# EAGLE schematic LM399_reference_board (EAGLE 7.2.0)
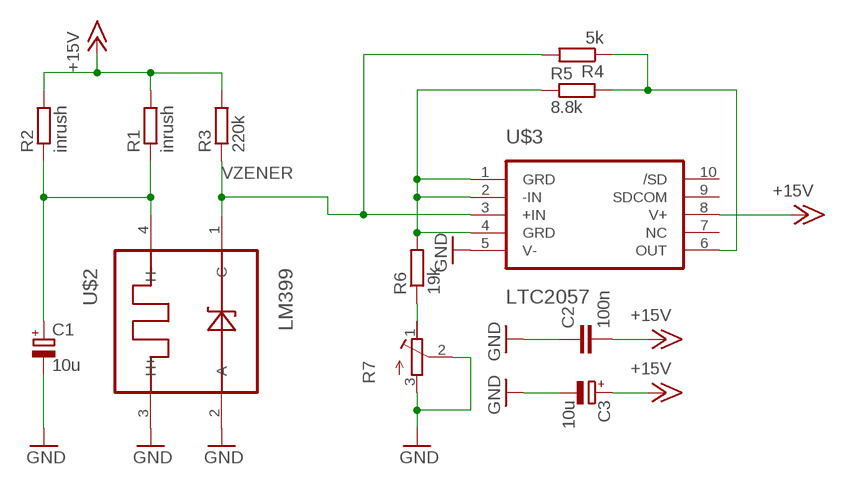
[diagram p0: schematic, sheet 1]

## Parts
C1  10u  CPOL-EUSMCD  [SMC_D]
C2  100n  C-EUC0603  [C0603]
C3  10u  CPOL-EUSMCD  [SMC_D]
R1  inrush  R-EU_R1206  [R1206]
R2  inrush  R-EU_0309/12  [0309/12]
R3  220k  R-EU_0207/10  [0207/10]
R4  5k  R-EU_0207/10  [0207/10]
R5  8.8k  R-EU_0207/10  [0207/10]
R6  19k  R-EU_0207/10  [0207/10]
R7  R-TRIMMT93YA  [RTRIMT93YA]
U$2  LM399  [H4-TO46-4PIN]
U$3  LTC2057  [MS-MSOP10]

## Nets
+15V: C2.2 C3.+ R1.2 R2.2 R3.2 U$3.8(V+)
GND: C1.- C2.1 C3.- R7.2(S) R7.3(E) U$2.2(A) U$2.3(H+) U$3.5(V-)
N$5: C1.+ R1.1 R2.1 U$2.4(H-)
N$6: R5.1 R6.2 U$3.1(GRD) U$3.2(-IN) U$3.4(GRD)
N$7: R4.1 R5.2 U$3.6(OUT)
N$8: R6.1 R7.1(A)
VZENER: R3.1 R4.2 U$2.1(C) U$3.3(+IN)
Unconnected: U$3.7(NC) U$3.9(SDCOM) U$3.10(/SD)

## Library data of the parts
C1 C3 = SquantorRCL:CPOL-EU: POLARIZED CAPACITOR, European symbol
C2 = SquantorRCL:C-EU: CAPACITOR, European symbol
R1-R6 = SquantorRCL:R-EU_: RESISTOR, European symbol
R7 = SquantorRCL:R-TRIMM: Trimm resistor
U$2 = SquantorLinearTechnology:LM399
U$3 = SquantorLinearTechnology:LTC2057